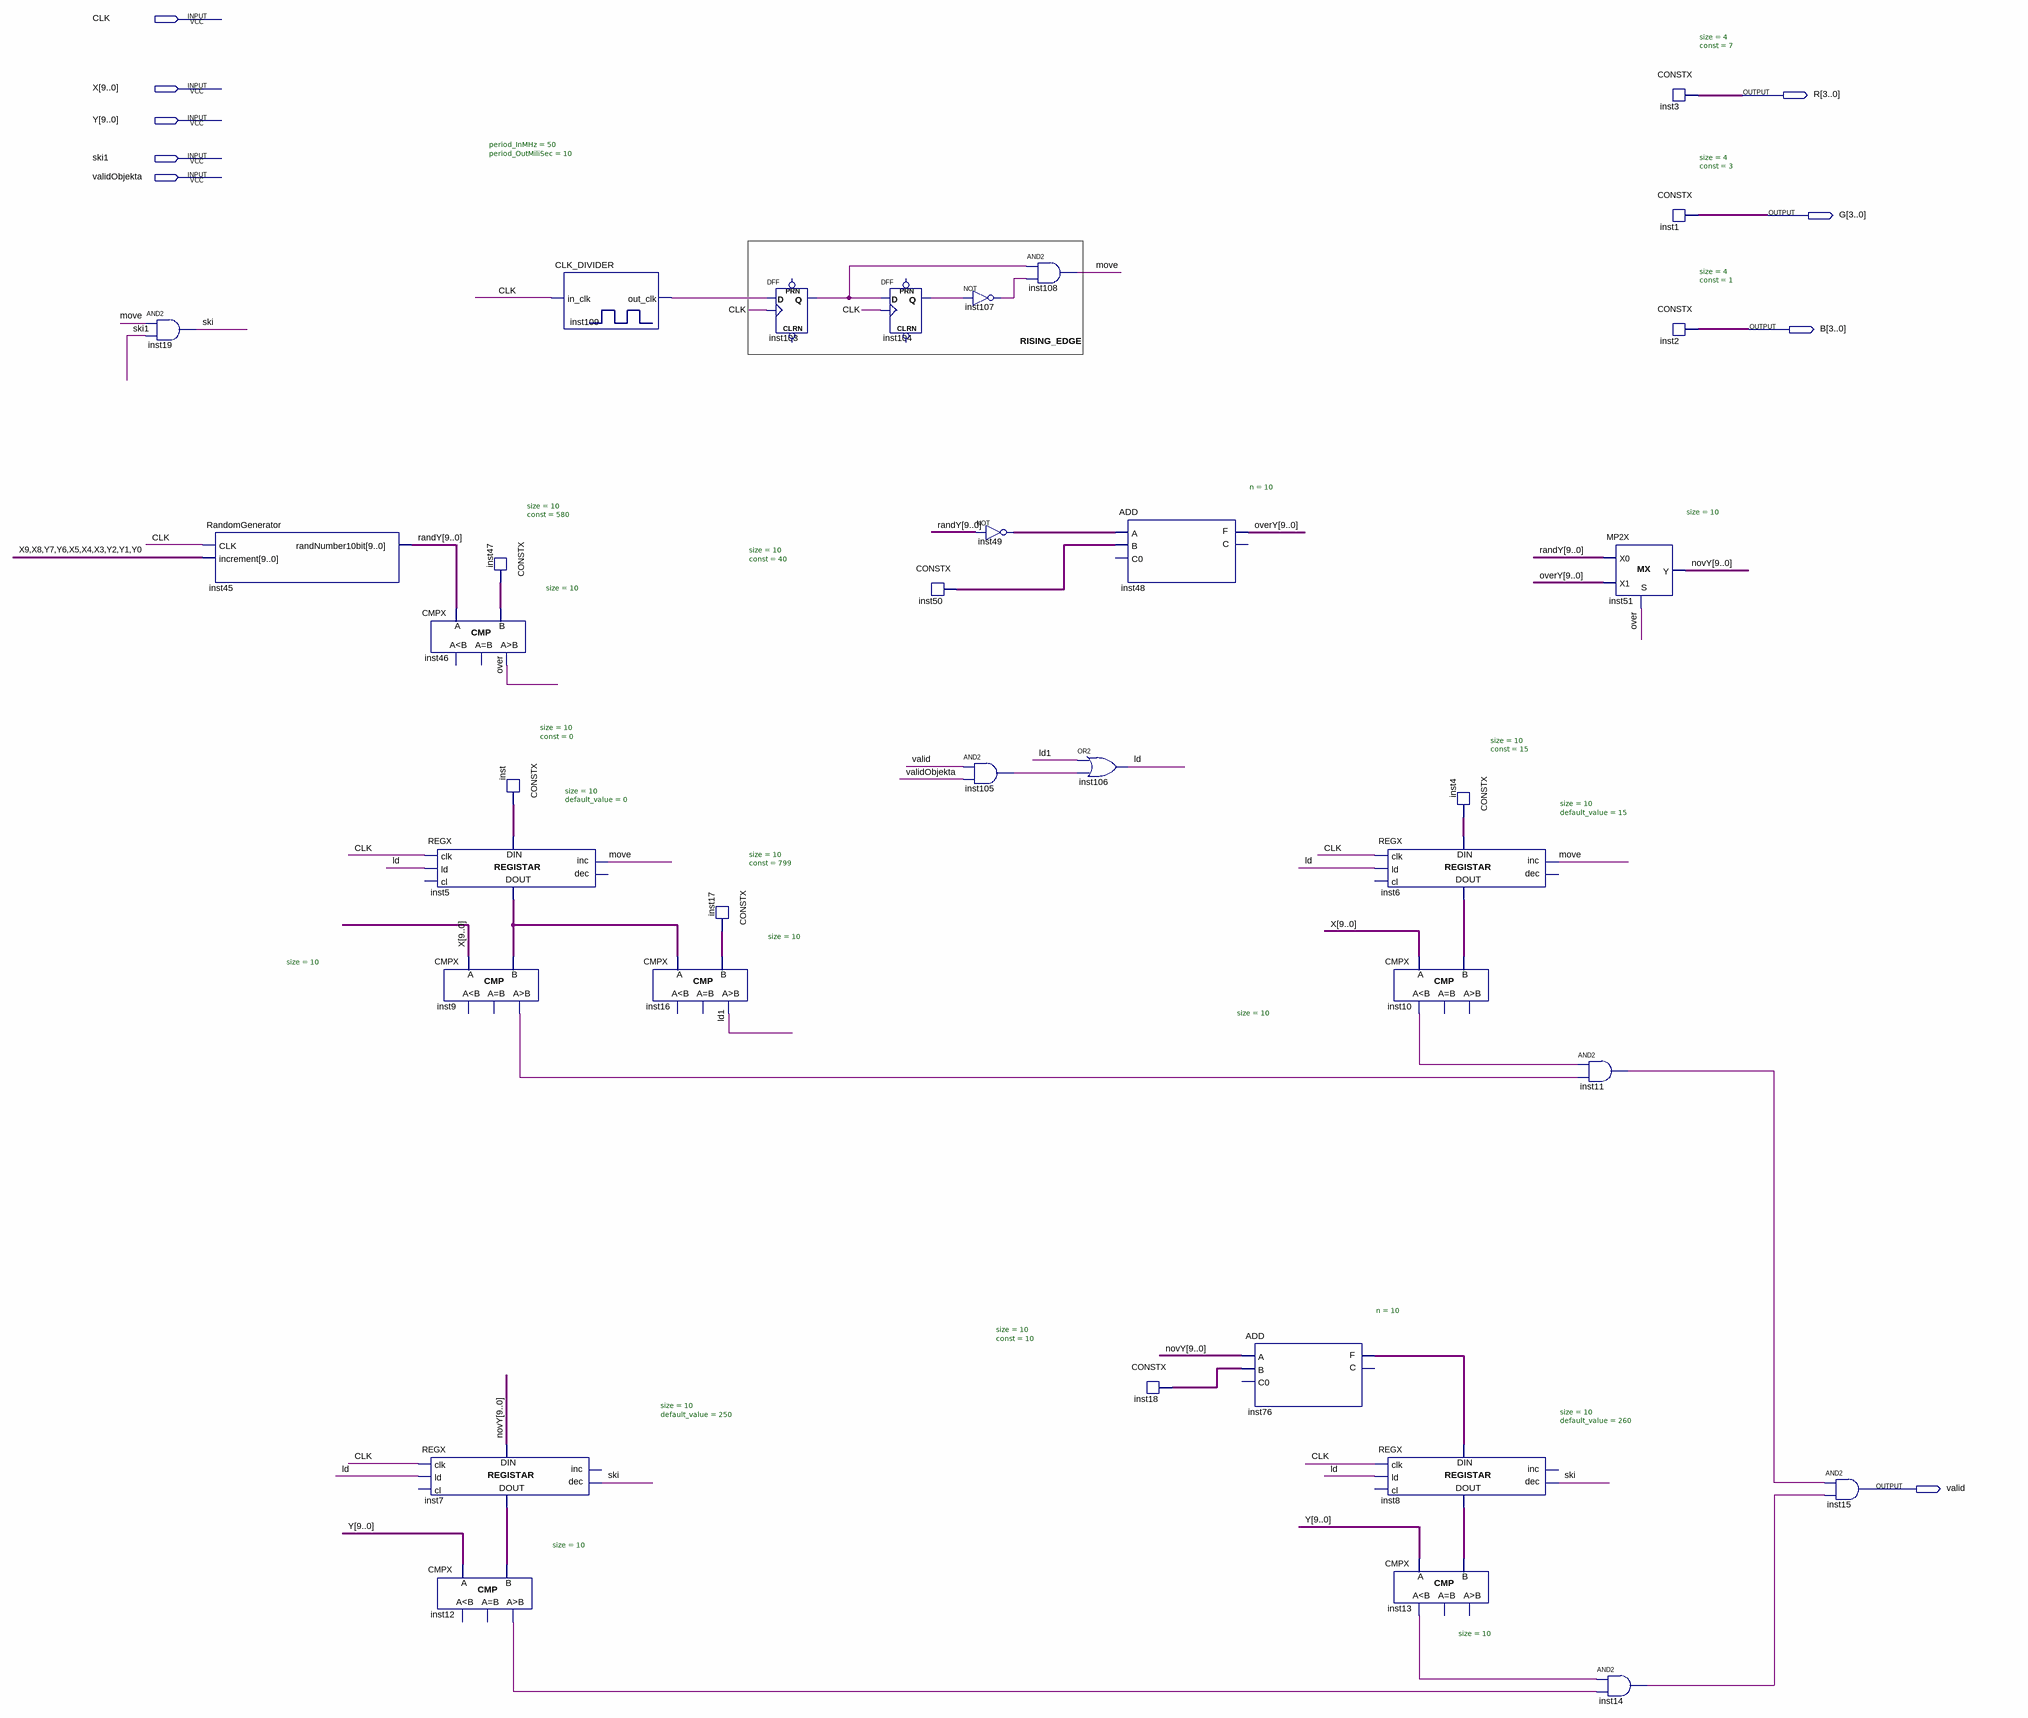
[diagram p0: schematic sheet]
// Quartus schematic Zivotinja.bdf as structural Verilog: 35 symbols, 9 pins
module Zivotinja (
  input  CLK,
  input  [9:0] X,
  input  [9:0] Y,
  input  ski1,
  input  validObjekta,
  output [3:0] R,
  output [3:0] G,
  output [3:0] B,
  output valid
);

  wire inst9_gr, inst10_ls, inst11_out, inst12_gr, inst13_ls, inst14_out, inst103_q, inst104_q, inst105_out,
       inst107_out, inst109_out_clk, ld, ld1, move, over, ski;
  wire [9:0] inst4_data, inst5_data_out, inst6_data_out, inst7_data_out, inst8_data_out, inst17_data,
       inst18_data, inst47_data, inst49_out, inst50_data, inst76_f, inst_data, novY, overY, randY;

  and inst19 (ski, move, ski1);
  RandomGenerator inst45 (.CLK(CLK), .increment({X[9:8], Y[7:6], X[5:3], Y[2:0]}), .randNumber10bit(randY));
  CMPX #(.size(10)) inst46 (.A(randY), .B(inst47_data), .gr(over));  // open: ls, eq
  REGX #(.size(10), .default_value(0)) inst5 (
    .clk(CLK), .ld(ld), .inc(move), .data_in(inst_data), .data_out(inst5_data_out));  // open: cl, dec
  CMPX #(.size(10)) inst9 (.A(X), .B(inst5_data_out), .gr(inst9_gr));  // open: ls, eq
  REGX #(.size(10), .default_value(250)) inst7 (
    .clk(CLK), .ld(ld), .dec(ski), .data_in(novY), .data_out(inst7_data_out));  // open: cl, inc
  CMPX #(.size(10)) inst12 (.A(Y), .B(inst7_data_out), .gr(inst12_gr));  // open: ls, eq
  CONSTX #(.size(10), .\const (580)) inst47 (.data(inst47_data));
  CONSTX #(.size(10), .\const (0)) inst (.data(inst_data));
  CLK_DIVIDER #(.period_InMHz(50), .period_OutMiliSec(10)) inst109 (.in_clk(CLK), .out_clk(inst109_out_clk));
  CMPX #(.size(10)) inst16 (.A(inst5_data_out), .B(inst17_data), .gr(ld1));  // open: ls, eq
  CONSTX #(.size(10), .\const (799)) inst17 (.data(inst17_data));
  DFF inst103 (.CLK(CLK), .D(inst109_out_clk), .Q(inst103_q));  // open: CLRN, PRN
  DFF inst104 (.CLK(CLK), .D(inst103_q), .Q(inst104_q));  // open: CLRN, PRN
  CONSTX #(.size(10), .\const (40)) inst50 (.data(inst50_data));
  not inst107 (inst107_out, inst104_q);
  and inst105 (inst105_out, valid, validObjekta);
  assign inst49_out = ~randY;  // NOT inst49, 10 bits wide
  and inst108 (move, inst103_q, inst107_out);
  ADD #(.n(10)) inst48 (.A(inst49_out), .B(inst50_data), .F(overY));  // open: C0, C
  or inst106 (ld, ld1, inst105_out);
  CONSTX #(.size(10), .\const (10)) inst18 (.data(inst18_data));
  ADD #(.n(10)) inst76 (.A(novY), .B(inst18_data), .F(inst76_f));  // open: C0, C
  REGX #(.size(10), .default_value(15)) inst6 (
    .clk(CLK), .ld(ld), .inc(move), .data_in(inst4_data), .data_out(inst6_data_out));  // open: cl, dec
  CMPX #(.size(10)) inst10 (.A(X), .B(inst6_data_out), .ls(inst10_ls));  // open: eq, gr
  REGX #(.size(10), .default_value(260)) inst8 (
    .clk(CLK), .ld(ld), .dec(ski), .data_in(inst76_f), .data_out(inst8_data_out));  // open: cl, inc
  CMPX #(.size(10)) inst13 (.A(Y), .B(inst8_data_out), .ls(inst13_ls));  // open: eq, gr
  CONSTX #(.size(10), .\const (15)) inst4 (.data(inst4_data));
  MP2X #(.size(10)) inst51 (.S(over), .X0(randY), .X1(overY), .Y(novY));
  and inst11 (inst11_out, inst10_ls, inst9_gr);
  and inst14 (inst14_out, inst13_ls, inst12_gr);
  CONSTX #(.size(4), .\const (7)) inst3 (.data(R));
  CONSTX #(.size(4), .\const (3)) inst1 (.data(G));
  CONSTX #(.size(4), .\const (1)) inst2 (.data(B));
  and inst15 (valid, inst11_out, inst14_out);

  // Notes on the sheet:
  //   RISING_EDGE
endmodule
